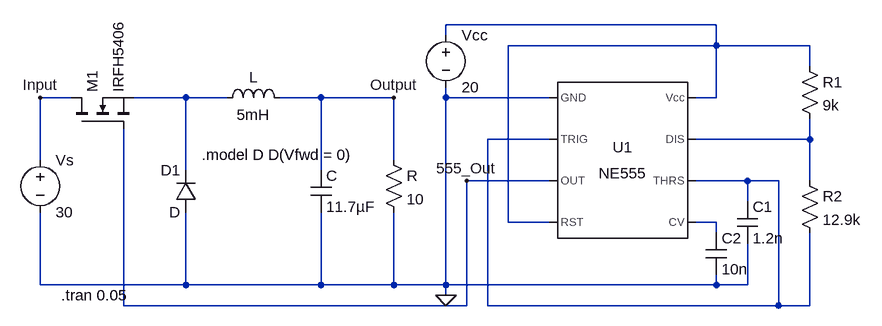
[diagram p0: schematic DC-DC Buck Converter.asc]
DC-DC Buck Converter.asc, the LTspice schematic file:
Version 4
SHEET 1 1176 680
WIRE 976 -32 560 -32
WIRE 560 -16 560 -32
WIRE 976 0 976 -32
WIRE 976 0 656 0
WIRE 1120 0 976 0
WIRE 1120 32 1120 0
WIRE -16 80 -64 80
WIRE 160 80 80 80
WIRE 224 80 160 80
WIRE 368 80 304 80
WIRE 480 80 368 80
WIRE 560 80 560 64
WIRE 720 80 560 80
WIRE 976 80 976 0
WIRE 976 80 944 80
WIRE 720 144 624 144
WIRE 1120 144 1120 112
WIRE 1120 144 944 144
WIRE -64 176 -64 80
WIRE 480 176 480 80
WIRE 160 192 160 80
WIRE 368 192 368 80
WIRE 720 208 592 208
WIRE 1024 208 944 208
WIRE 1072 208 1024 208
WIRE 1120 208 1120 144
WIRE 1024 240 1024 208
WIRE 656 272 656 0
WIRE 720 272 656 272
WIRE 976 272 944 272
WIRE 976 288 976 272
WIRE -64 368 -64 256
WIRE 160 368 160 256
WIRE 160 368 -64 368
WIRE 368 368 368 256
WIRE 368 368 160 368
WIRE 480 368 480 256
WIRE 480 368 368 368
WIRE 560 368 560 80
WIRE 560 368 480 368
WIRE 976 368 976 352
WIRE 976 368 560 368
WIRE 1024 368 1024 304
WIRE 1024 368 976 368
WIRE 560 384 560 368
WIRE 64 400 64 128
WIRE 592 400 592 208
WIRE 592 400 64 400
WIRE 624 400 624 144
WIRE 1072 400 1072 208
WIRE 1072 400 624 400
WIRE 1120 400 1120 288
WIRE 1120 400 1072 400
FLAG -64 80 Input
FLAG 480 80 Output
FLAG 560 384 0
FLAG 592 208 555_Out
SYMBOL ind 208 96 R270
WINDOW 0 32 56 VTop 2
WINDOW 3 5 56 VBottom 2
SYMATTR InstName L
SYMATTR Value 5mH
SYMBOL cap 352 192 R0
SYMATTR InstName C
SYMATTR Value 11.7µF
SYMBOL res 464 160 R0
SYMATTR InstName R
SYMATTR Value 10
SYMBOL voltage -64 160 R0
WINDOW 123 0 0 Left 0
WINDOW 39 0 0 Left 0
SYMATTR InstName Vs
SYMATTR Value 30
SYMBOL nmos -16 128 R270
SYMATTR InstName M1
SYMATTR Value IRFH5406
SYMBOL Misc\\NE555 832 176 R0
SYMATTR InstName U1
SYMBOL res 1104 192 R0
SYMATTR InstName R2
SYMATTR Value 12.9k
SYMBOL res 1104 16 R0
SYMATTR InstName R1
SYMATTR Value 9k
SYMBOL cap 1008 240 R0
SYMATTR InstName C1
SYMATTR Value 1.2n
SYMBOL cap 960 288 R0
SYMATTR InstName C2
SYMATTR Value 10n
SYMBOL voltage 560 -32 R0
WINDOW 123 0 0 Left 0
WINDOW 39 0 0 Left 0
SYMATTR InstName Vcc
SYMATTR Value 20
SYMBOL diode 176 256 R180
WINDOW 0 24 64 Left 2
WINDOW 3 24 0 Left 2
SYMATTR InstName D1
TEXT -32 384 Left 2 !.tran 0.05
TEXT 184 168 Left 2 !.model D D(Vfwd = 0)

The netlist it stands for:
* DC-DC Buck Converter.asc
L N002 Output 5mH
C Output 0 11.7µF
R Output 0 10
Vs Input 0 30
M1 Input 555_Out N002 N002 IRFH5406
XU1 0 N003 555_Out N001 N005 N003 N004 N001 NE555  ; pins GND TRIG OUT RST CV THRS DIS Vcc
R2 N004 N003 12.9k
R1 N001 N004 9k
C1 N003 0 1.2n
C2 N005 0 10n
Vcc N001 0 20
D1 0 N002 D
.model D D
.lib standard.dio
.model NMOS NMOS
.model PMOS PMOS
.lib standard.mos
.tran 0.05
.model D D(Vfwd = 0)
.lib NE555.sub
.backanno
.end